# Altium schematic sheet RADC-ModuleConnect-S07-V00.SchDoc: RADC ModuleConnect (60Pin 0.5mm FFC Connector)
size A3; DrawnBy: Jonn Dillon; DocumentNumber: 4; SheetNumber: 4; SheetTotal: 8; Version: 00; Project: QUTMS RADIO COMPUTE; PageSetup: Record=PageOptions|CenterHorizontal=True|CenterVertical=True|PrintScale=0.97|XCorrection=1.00|YCorrection=1.00|PrintKind=0|BorderSize=5000000|LeftOffset=0|BottomOffset=0|Orientation=2|PaperLength=1000|PaperWidth=1000|Scale=100|PaperSource=7|PrintQuality=-4|MediaType=1|DitherType=10|PaperKind=A4|PrintScaleMode=1
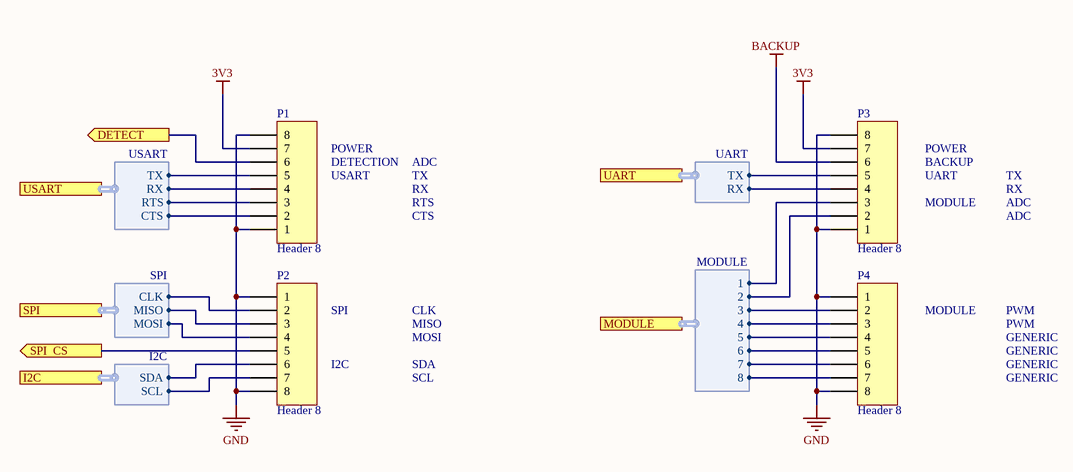
[diagram p0: RADC-ModuleConnect-S07-V00.SchDoc]

## Parts
P1  Header 8  [HDR1X8]
P2  Header 8  [HDR1X8]
P3  Header 8  [HDR1X8]
P4  Header 8  [HDR1X8]

## Ports
DETECT (out), I2C (harness I2C), MODULE (harness MODULE), SPI  CS (out), SPI (harness SPI), UART (harness UART), USART (harness USART)

## Harnesses
SPI: MISO, MOSI, CLK
UART: TX, RX
I2C: SDA, SCL
MODULE: 1, 2, 3, 4, 5, 6, 7, 8
USART: TX, RX, RTS, CTS

## Nets
3V3: P1.7 P3.7
BACKUP: P3.6
GND: P1.1 P1.8 P2.1 P2.8 P3.1 P3.8 P4.1 P4.8
DETECT: P1.6 ; port DETECT
SPI  CS: P2.5 ; port SPI  CS
NetP1_2: P1.2 ; port USART.CTS
NetP1_3: P1.3 ; port USART.RTS
NetP1_4: P1.4 ; port USART.RX
NetP1_5: P1.5 ; port USART.TX
NetP2_2: P2.2 ; port SPI.CLK
NetP2_3: P2.3 ; port SPI.MISO
NetP2_4: P2.4 ; port SPI.MOSI
NetP2_6: P2.6 ; port I2C.SDA
NetP2_7: P2.7 ; port I2C.SCL
NetP3_2: P3.2 ; port MODULE.2
NetP3_3: P3.3 ; port MODULE.1
NetP3_4: P3.4 ; port UART.RX
NetP3_5: P3.5 ; port UART.TX
NetP4_2: P4.2 ; port MODULE.3
NetP4_3: P4.3 ; port MODULE.4
NetP4_4: P4.4 ; port MODULE.5
NetP4_5: P4.5 ; port MODULE.6
NetP4_6: P4.6 ; port MODULE.7
NetP4_7: P4.7 ; port MODULE.8

## Notes on the sheet
- DETECTION
- USART
- POWER
- ADC
- TX
- RX
- BACKUP
- UART
- RTS
- CTS
- MODULE
- SPI
- CLK
- MISO
- PWM
- I2C
- SDA
- SCL
- MOSI
- GENERIC
- Revision History:
- Sheet Title:
- Rev
- Date
- Description
- Project:
- Size:
- Drawn By:
- A3
- Number:
- Revision:
- Sheet
- Version:
- of
- QUT Motorsport
- O-120, Gardens Point
- 2 George Street
- Brisbane, QLD 4000
- Australia
- Print Date:
- Print Time:
- File Name:

## Library data of the parts
P1-P4 = Header 8: Header, 8-Pin; LatestRevisionDate: 17-Jul-2002; LatestRevisionNote: Re-released for DXP Platform.; Publisher: Altium Limited